# Altium schematic sheet SD.schdoc: =
size A4; Symbol: Sheet-Symbol_A4; Company: 嘉立创EDA; Version: V1.0; Page Size: A4; @Project Name: RK3568B2地瓜派; @Page Count: 26; @Update Date: 2025-09-11; @Create Date: 2025-09-11; @Schematic Name: Schematic1; @Page No: 22; @Page Name: SD; Device: Sheet-Symbol_A4; Border: 1; Title Block Position: 3; Width: 1170; Height: 825; Region Start: 1; X Region Count: 6; Y Region Count: 4; Blade Width: 10; @Board Name: Board1; @Create Time: 22:25:58; @Update Time: 22:26:15; Organization: ORGANIZATION; Address1: ADDRESS 1; Address2: ADDRESS 2; Address3: ADDRESS 3; Address4: ADDRESS 4; SheetNumber: 20; SheetTotal: 28
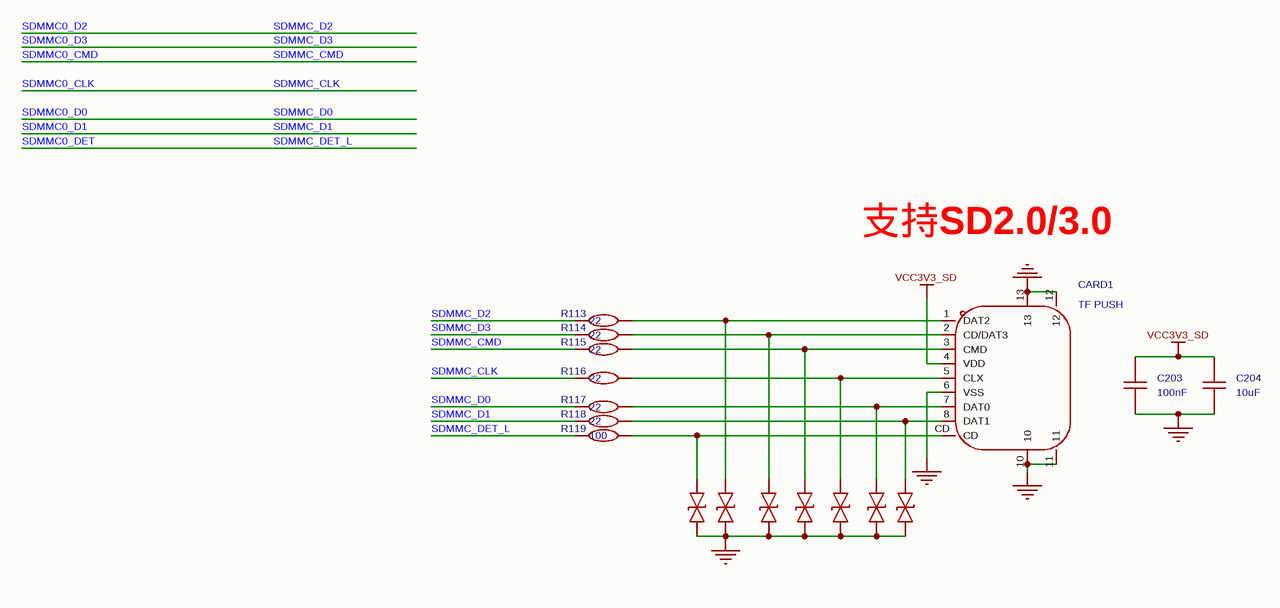
[diagram p0: SD.schdoc]

## Parts
C203  100nF  [C0603]
C204  value 10uF  [MYC0402]  (hidden comment: CL10A105KB8NNNC)
CARD1  TF PUSH  [TF-SMD_TF-PUSH]
R113  22  [R0402]
R114  22  [R0402]
R115  22  [R0402]
R116  22  [R0402]
R117  22  [R0402]
R118  22  [R0402]
R119  100  [R0402]
U14  ESD5341N  [DFN1006-2L-BI]  (value not drawn)
U15  ESD5341N  [DFN1006-2L-BI]  (value not drawn)
U16  ESD5341N  [DFN1006-2L-BI]  (value not drawn)
U17  ESD5341N  [DFN1006-2L-BI]  (value not drawn)
U18  ESD5341N  [DFN1006-2L-BI]  (value not drawn)
U19  ESD5341N  [DFN1006-2L-BI]  (value not drawn)
U20  ESD5341N  [DFN1006-2L-BI]  (value not drawn)

## Nets
GND: C203.1 C204.2 CARD1.6(VSS) CARD1.10 CARD1.11 CARD1.12 CARD1.13 U14.1 U15.1 U16.1 U17.1 U18.1 U19.1 U20.1
VCC3V3_SD: C203.2 C204.1 CARD1.4(VDD)
SDMMC0_CLK: R116.1  [also labelled SDMMC_CLK]
SDMMC0_CMD: R115.1  [also labelled SDMMC_CMD]
SDMMC0_D0: R117.1  [also labelled SDMMC_D0]
SDMMC0_D1: R118.1  [also labelled SDMMC_D1]
SDMMC0_D2: R113.1  [also labelled SDMMC_D2]
SDMMC0_D3: R114.1  [also labelled SDMMC_D3]
SDMMC0_DET: R119.1  [also labelled SDMMC_DET_L]
NetCARD1_1: CARD1.1(DAT2) R113.2 U15.2
NetCARD1_2: CARD1.2(CD/DAT3) R114.2 U16.2
NetCARD1_3: CARD1.3(CMD) R115.2 U17.2
NetCARD1_5: CARD1.5(CLX) R116.2 U18.2
NetCARD1_7: CARD1.7(DAT0) R117.2 U19.2
NetCARD1_8: CARD1.8(DAT1) R118.2 U20.2
NetCARD1_CD: CARD1.CD R119.2 U14.2

## Notes on the sheet
- 支持SD2.0/3.0
- Drawn By :
- Checked By :
- Approved By :
- SheetNumber
- SheetTotal
- Revision :
- Time :
- Size :
- Date :
- A4
- DocumentName :
- Project :

## Library data of the parts
C203 = CAP_0603: ConvertToPcb: yes; SymbolName: Capacitance; ModelId: ac125912035d415993ca9572d50418b1; ModelName: C0603_L1.6-W0.8-H0.8; ModelTransform: 62.992,31.496,0,0,0,0,0,0,0; Device: CAP_0603; AddInBom: yes; Supplier Footprint: 0603; FootprintName: C0603; Value: 100nF
C204 = CL10A105KB8NNNC: 容值:1uF;精度:±10%;额定电压:50V;材质(温度系数):X5R;; Manufacturer: SAMSUNG(三星); Symbol: CapAcitance; AddInBom: yes; ModelId: ac125912035d415993ca9572d50418b1; ModelName: C0603_L1.6-W0.8-H0.8; ModelTransform: 62.992,31.496,0,0,0,0,0,0,0; Tolerance: ±10%; Voltage Rated: 50V; Temperature Coefficient: X5R; Device: CL10A105KB8NNNC; LCSC Part Name: 1uF ±10% 50V; ManufacturerPart: CL10A105KB8NNNC; Supplier Footprint: 0603; JLCPCB Part Class: Basic Part; Datasheet: https://atta.szlcsc.com/upload/public/pdf/source/20160103/1457707679084.pdf; Supplier: LCSC; ConvertToPcb: yes; FootprintName: MYC0402
CARD1 = TF PUSH: 卡连接方式:自弹式;卡类型:MicroSD卡(TF卡);连接器类型:卡座;本体最大高度:2mm;工作温度范围:-20℃~+90℃;; Manufacturer: SHOU HAN(首韩); AddInBom: yes; ModelId: 2d6270e77c9a43c6bb0aca962ba811a2; ModelTransform: 635.826,598.424,0,0,0,0,0.002,-82.441,-23.622; Card Connection Mode: 自弹式; Connector Type: 卡座; Additional Card Detection Pins: 无; Maximum Body Height: 2mm; Symbol: TF PUSH; Device: TF PUSH; LCSC Part Name: 自弹式 MicroSD卡(TF卡) 卡座; SupplierPart: C393941; ManufacturerPart: TF PUSH; Supplier Footprint: SMD; JLCPCB Part Class: 扩展库; Datasheet: https://atta.szlcsc.com/upload/public/pdf/source/20191011/C393941_0DDD896EE907FEB750D8B7B8982E2A67.pdf; Supplier: LCSC; ConvertToPcb: yes; FootprintName: TF-SMD_TF-PUSH; ModelName: TF-SMD_TF-PUSH; Card Type: MicroSD卡(TF卡); Supplementary Features: -; Operating Temperature Range: -20℃~+90℃
R113-R119 = Res_0402: Symbol: 电阻; 3D Model: 671aefced39d4c318694bba8bd8efd39; 3D Model Transform: 39.37,19.685,0,0,0,0,0,0.0005,0; ConvertToPcb: yes; ModelName: R0402_L1.0-W0.5-H0.5; Device: Res_0402; AddInBom: yes; Supplier Footprint: 0402; FootprintName: R0402
  R113-R118: Value: 22
  R119: Value: 100
U14-U20 = ESD5341N_C20612964: Manufacturer: KUU; AddInBom: yes; ModelId: 2bdbcca3b35b49c5a8ae725a08658930; ModelTransform: 40.1574,24.4094,0,0,0,0,0,0,0; Symbol: ESD5341N_C20612964; Device: ESD5341N_C20612964; LCSC Part Name: ESD静电保护管; SupplierPart: C20612964; ManufacturerPart: ESD5341N; Supplier Footprint: DFN1006-2L; JLCPCB Part Class: 扩展库; Datasheet: https://atta.szlcsc.com/upload/public/pdf/source/20240126/9EE8C033ACD76A81C21292FAA1DFE4C1.pdf; Supplier: LCSC; ConvertToPcb: yes; FootprintName: DFN1006-2L-BI; ModelName: DFN1006-2L-BI